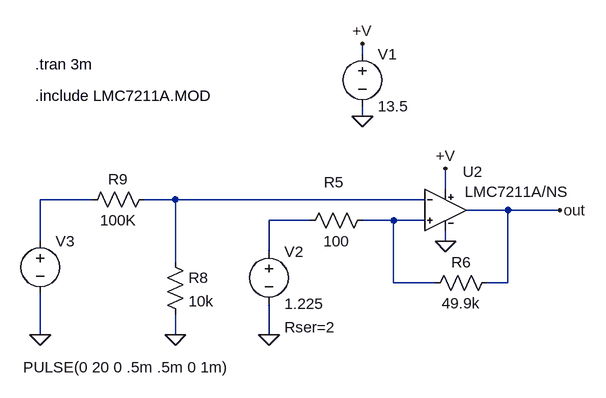
[diagram p0: schematic LMC7211_comp1.asc]
LMC7211_comp1.asc, the LTspice schematic file:
Version 4
SHEET 1 964 6020
WIRE 80 0 80 -16
WIRE 80 96 80 80
WIRE 208 208 208 176
WIRE -336 224 -416 224
WIRE -208 224 -256 224
WIRE 176 224 -208 224
WIRE 304 240 240 240
WIRE 384 240 304 240
WIRE 0 256 -64 256
WIRE 128 256 80 256
WIRE 176 256 128 256
WIRE -416 288 -416 224
WIRE 208 288 208 272
WIRE -64 304 -64 256
WIRE -208 320 -208 224
WIRE 128 352 128 256
WIRE 192 352 128 352
WIRE 304 352 304 240
WIRE 304 352 272 352
WIRE -416 432 -416 368
WIRE -208 432 -208 400
WIRE -64 432 -64 384
FLAG 80 96 0
FLAG 80 -16 +V
FLAG 208 176 +V
FLAG -416 432 0
FLAG -64 432 0
FLAG 208 288 0
FLAG -208 432 0
FLAG 384 240 out
SYMBOL voltage 80 -16 R0
WINDOW 123 0 0 Left 0
WINDOW 39 0 0 Left 0
SYMATTR InstName V1
SYMATTR Value 13.5
SYMBOL voltage -416 272 R0
WINDOW 3 -26 210 Left 0
WINDOW 123 0 0 Left 0
WINDOW 39 0 0 Left 0
SYMATTR Value PULSE(0 20 0 .5m .5m 0 1m)
SYMATTR InstName V3
SYMBOL voltage -64 288 R0
WINDOW 123 0 0 Left 0
WINDOW 39 24 132 Left 0
SYMATTR SpiceLine Rser=2
SYMATTR InstName V2
SYMATTR Value 1.225
SYMBOL res -224 304 R0
SYMATTR InstName R8
SYMATTR Value 10k
SYMBOL res -240 208 R90
WINDOW 0 0 56 VBottom 0
WINDOW 3 32 56 VTop 0
SYMATTR InstName R9
SYMATTR Value 100K
SYMBOL res 96 240 R90
WINDOW 0 -27 60 VBottom 0
WINDOW 3 32 56 VTop 0
SYMATTR InstName R5
SYMATTR Value 100
SYMBOL res 288 336 R90
WINDOW 0 0 56 VBottom 0
WINDOW 3 32 56 VTop 0
SYMATTR InstName R6
SYMATTR Value 49.9k
SYMBOL xopamp_lm 208 176 R0
WINDOW 0 27 5 Left 0
WINDOW 38 30 36 Left 0
SYMATTR InstName U2
SYMATTR SpiceModel LMC7211A/NS
TEXT -424 16 Left 0 !.tran 3m
TEXT -424 64 Left 0 !.include LMC7211A.MOD

The netlist it stands for:
* LMC7211_comp1.asc
V1 +V 0 13.5
V3 N001 0 PULSE(0 20 0 .5m .5m 0 1m)
V2 N003 0 1.225 Rser=2
R8 N002 0 10k
R9 N002 N001 100K
R5 N004 N003 100
R6 out N004 49.9k
XU2 N004 N002 out +V 0 LMC7211A/NS  ; pins In+ In- OUT V+ V-
.tran 3m
.include LMC7211A.MOD
.backanno
.end